# Altium schematic sheet Connector.SchDoc
size A2; SheetNumber: 2; SheetTotal: 6
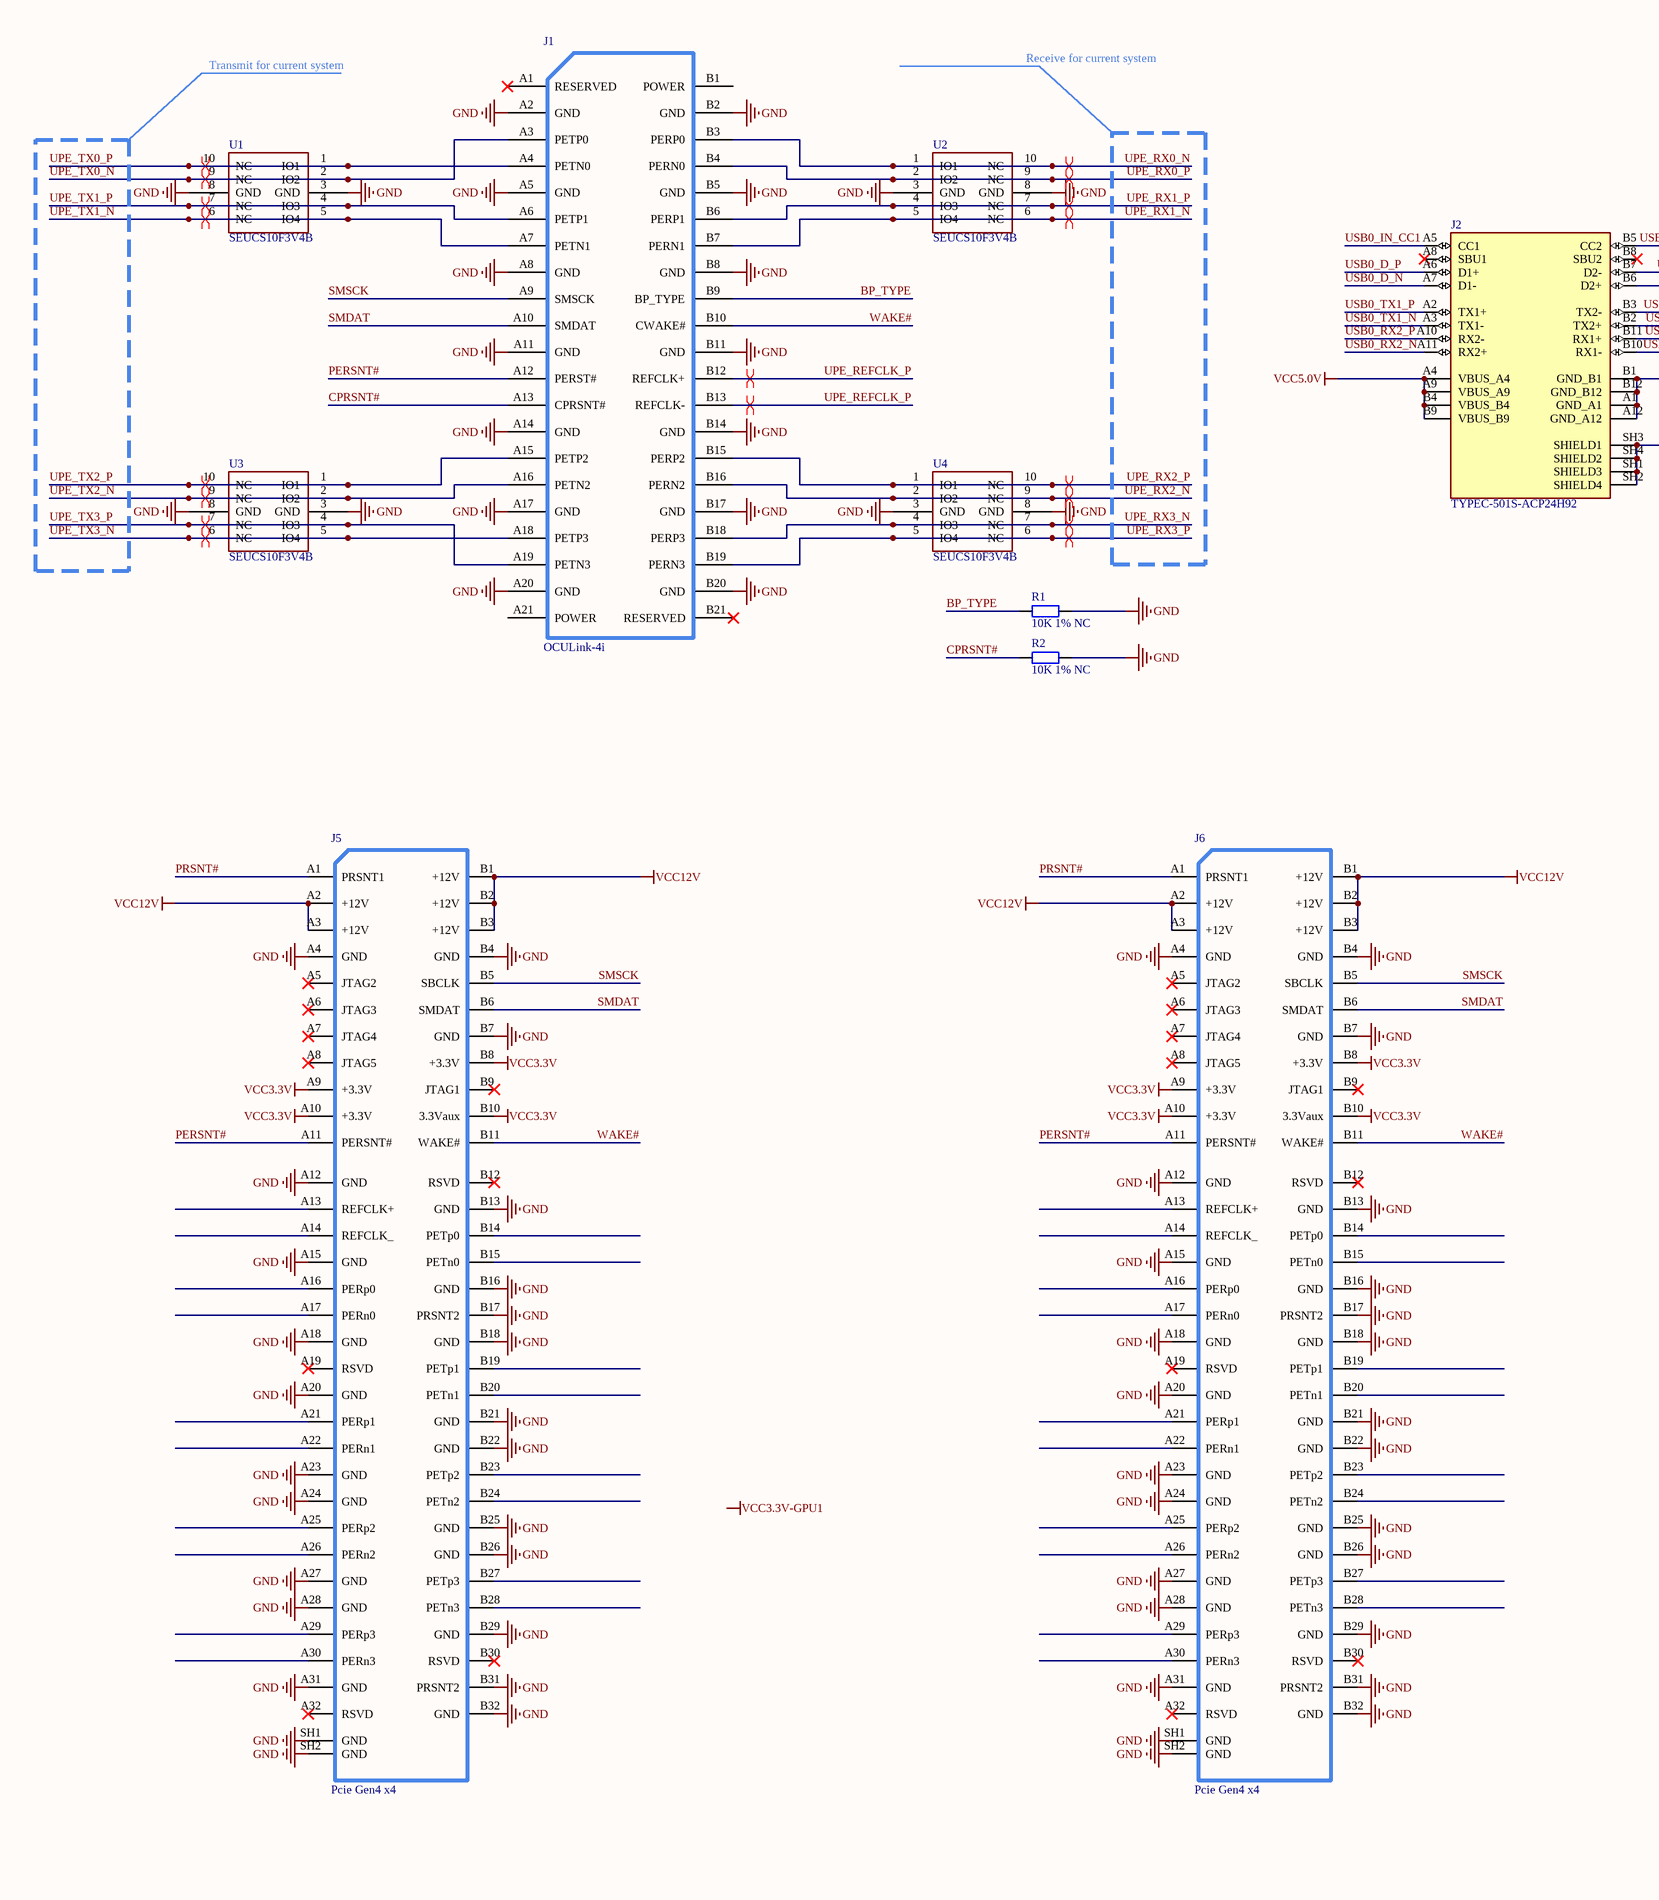
[diagram p0: Connector.SchDoc, left]
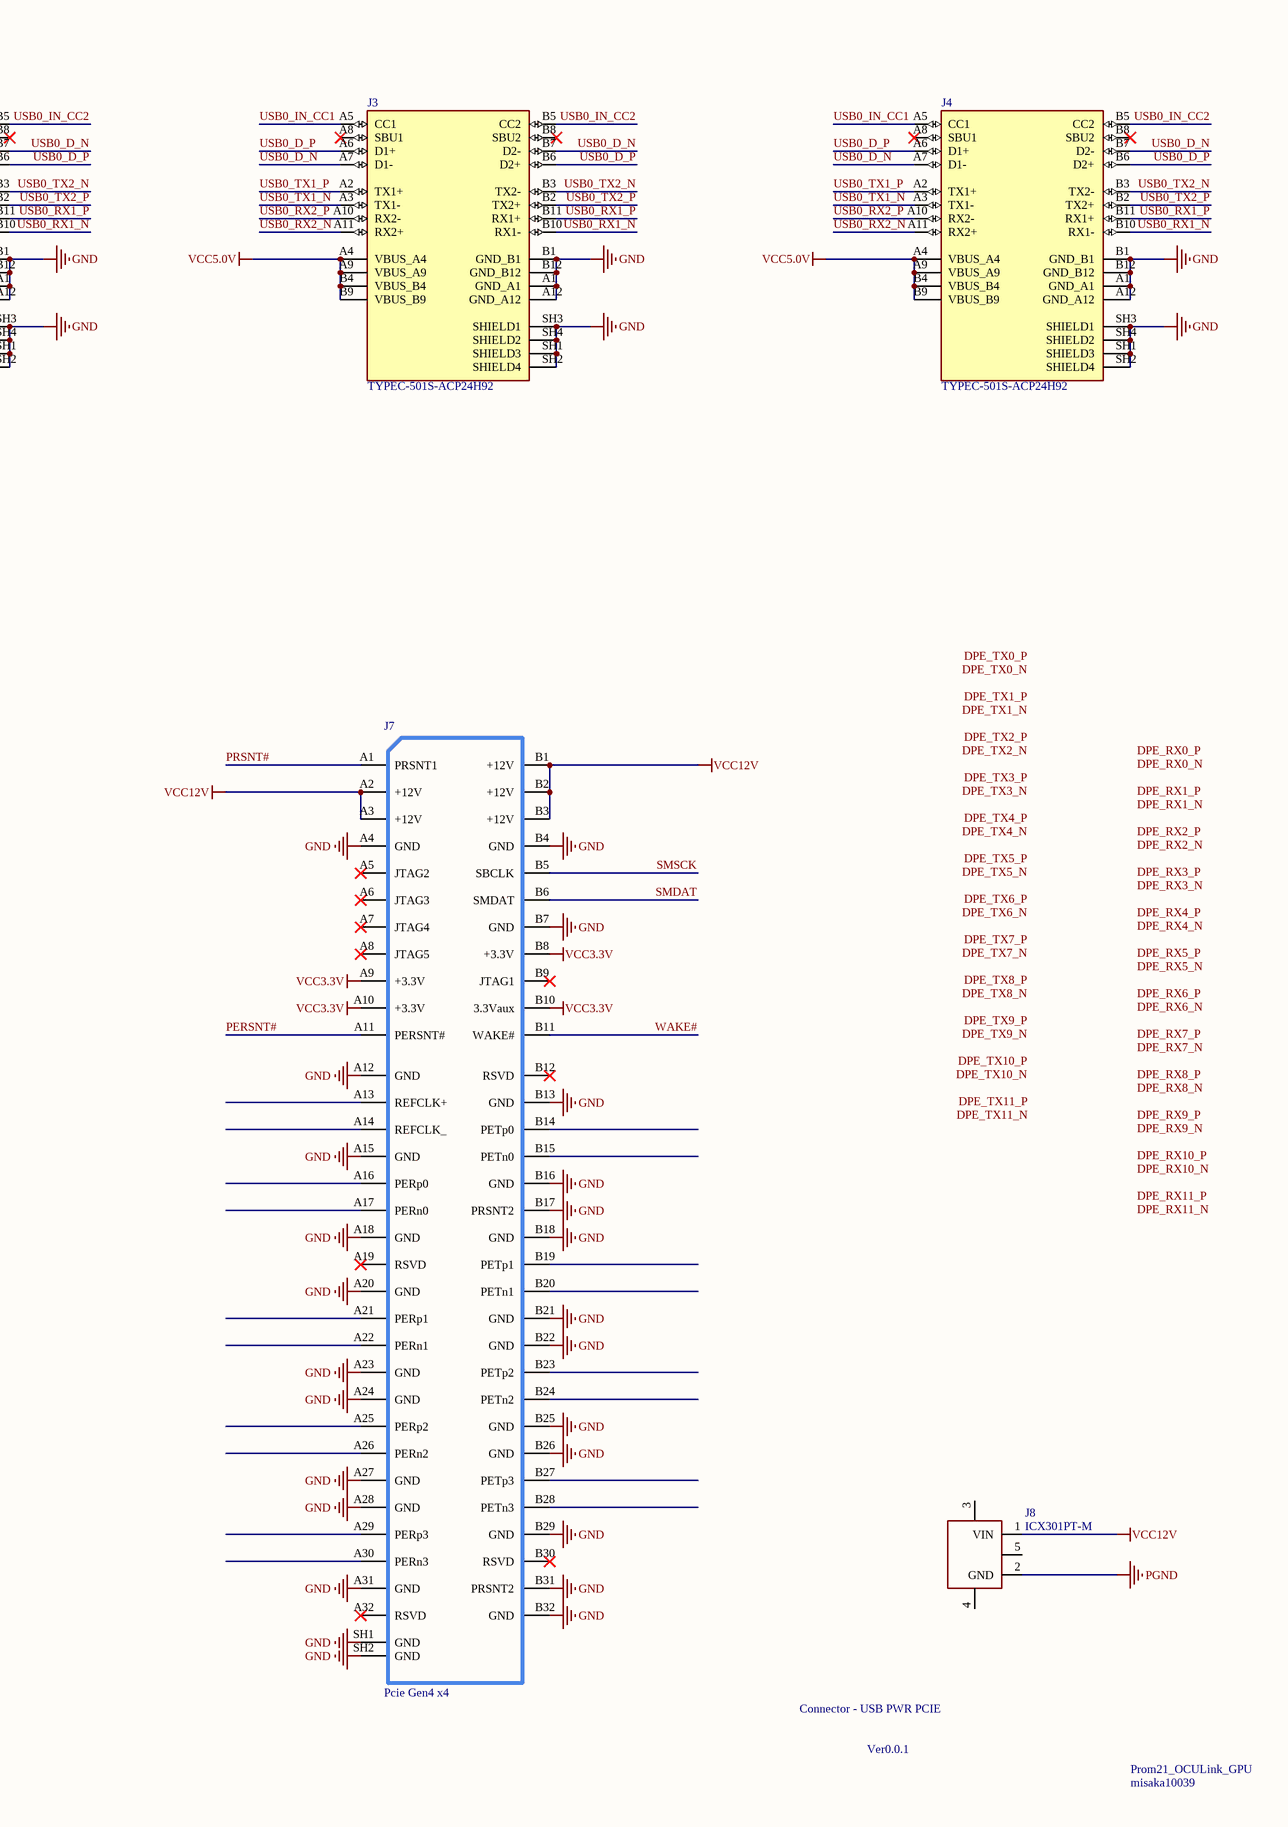
[diagram p1: Connector.SchDoc, right]

## Parts
J1  OCULink-4i  [SFF8611_卧式]
J2  TYPEC-501S-ACP24H92  [USB-C 24P Molex]
J3  TYPEC-501S-ACP24H92  [USB-C 24P Molex]
J4  TYPEC-501S-ACP24H92  [USB-C 24P Molex]
J5  Pcie Gen4 x4  [PCIe Gen4 X4 贴片]
J6  Pcie Gen4 x4  [PCIe Gen4 X4 贴片]
J7  Pcie Gen4 x4  [PCIe Gen4 X4 贴片]
J8  ICX301PT-M  [CONN-SMD_ICX301PT-M]
R1  10K 1% NC  [R0402_L]
R2  10K 1% NC  [R0402_L]
U1  SEUCS10F3V4B  [DIO_TPD4E02B04DQAR]
U2  SEUCS10F3V4B  [DIO_TPD4E02B04DQAR]
U3  SEUCS10F3V4B  [DIO_TPD4E02B04DQAR]
U4  SEUCS10F3V4B  [DIO_TPD4E02B04DQAR]

## Nets
GND: J1.A2(GND) J1.A5(GND) J1.A8(GND) J1.A11(GND) J1.A14(GND) J1.A17(GND) J1.A20(GND) J1.B2(GND) J1.B5(GND) J1.B8(GND) J1.B11(GND) J1.B14(GND) J1.B17(GND) J1.B20(GND) J2.A1(GND_A1) J2.A12(GND_A12) J2.B1(GND_B1) J2.B12(GND_B12) J2.SH1(SHIELD3) J2.SH2(SHIELD4) J2.SH3(SHIELD1) J2.SH4(SHIELD2) J3.A1(GND_A1) J3.A12(GND_A12) J3.B1(GND_B1) J3.B12(GND_B12) J3.SH1(SHIELD3) J3.SH2(SHIELD4) J3.SH3(SHIELD1) J3.SH4(SHIELD2) J4.A1(GND_A1) J4.A12(GND_A12) J4.B1(GND_B1) J4.B12(GND_B12) J4.SH1(SHIELD3) J4.SH2(SHIELD4) J4.SH3(SHIELD1) J4.SH4(SHIELD2) J5.A4(GND) J5.A12(GND) J5.A15(GND) J5.A18(GND) J5.A20(GND) J5.A23(GND) J5.A24(GND) J5.A27(GND) J5.A28(GND) J5.A31(GND) J5.B4(GND) J5.B7(GND) J5.B13(GND) J5.B16(GND) J5.B17(PRSNT2) J5.B18(GND) J5.B21(GND) J5.B22(GND) J5.B25(GND) J5.B26(GND) J5.B29(GND) J5.B31(PRSNT2) J5.B32(GND) J5.SH1(GND) J5.SH2(GND) J6.A4(GND) J6.A12(GND) J6.A15(GND) J6.A18(GND) J6.A20(GND) J6.A23(GND) J6.A24(GND) J6.A27(GND) J6.A28(GND) J6.A31(GND) J6.B4(GND) J6.B7(GND) J6.B13(GND) J6.B16(GND) J6.B17(PRSNT2) J6.B18(GND) J6.B21(GND) J6.B22(GND) J6.B25(GND) J6.B26(GND) J6.B29(GND) J6.B31(PRSNT2) J6.B32(GND) J6.SH1(GND) J6.SH2(GND) J7.A4(GND) J7.A12(GND) J7.A15(GND) J7.A18(GND) J7.A20(GND) J7.A23(GND) J7.A24(GND) J7.A27(GND) J7.A28(GND) J7.A31(GND) J7.B4(GND) J7.B7(GND) J7.B13(GND) J7.B16(GND) J7.B17(PRSNT2) J7.B18(GND) J7.B21(GND) J7.B22(GND) J7.B25(GND) J7.B26(GND) J7.B29(GND) J7.B31(PRSNT2) J7.B32(GND) J7.SH1(GND) J7.SH2(GND) R1.1 R2.1 U1.3(GND) U1.8(GND) U2.3(GND) U2.8(GND) U3.3(GND) U3.8(GND) U4.3(GND) U4.8(GND)
PGND: J8.2(GND)
VCC3.3V: J5.A9(+3.3V) J5.A10(+3.3V) J5.B8(+3.3V) J5.B10(3.3Vaux) J6.A9(+3.3V) J6.A10(+3.3V) J6.B8(+3.3V) J6.B10(3.3Vaux) J7.A9(+3.3V) J7.A10(+3.3V) J7.B8(+3.3V) J7.B10(3.3Vaux)
VCC5.0V: J2.A4(VBUS_A4) J2.A9(VBUS_A9) J2.B4(VBUS_B4) J2.B9(VBUS_B9) J3.A4(VBUS_A4) J3.A9(VBUS_A9) J3.B4(VBUS_B4) J3.B9(VBUS_B9) J4.A4(VBUS_A4) J4.A9(VBUS_A9) J4.B4(VBUS_B4) J4.B9(VBUS_B9)
VCC12V: J5.A2(+12V) J5.A3(+12V) J5.B1(+12V) J5.B2(+12V) J5.B3(+12V) J6.A2(+12V) J6.A3(+12V) J6.B1(+12V) J6.B2(+12V) J6.B3(+12V) J7.A2(+12V) J7.A3(+12V) J7.B1(+12V) J7.B2(+12V) J7.B3(+12V) J8.1(VIN)
BP_TYPE: J1.B9(BP_TYPE) R1.2
CPRSNT#: J1.A13(CPRSNT#) R2.2
PERSNT#: J1.A12(PERST#) J5.A11(PERSNT#) J6.A11(PERSNT#) J7.A11(PERSNT#)
PRSNT#: J5.A1(PRSNT1) J6.A1(PRSNT1) J7.A1(PRSNT1)
SMDAT: J1.A10(SMDAT) J5.B6(SMDAT) J6.B6(SMDAT) J7.B6(SMDAT)
SMSCK: J1.A9(SMSCK) J5.B5(SBCLK) J6.B5(SBCLK) J7.B5(SBCLK)
UPE_REFCLK_P: J1.B12(REFCLK+) J1.B13(REFCLK-)
UPE_RX0_N: J1.B3(PERP0) U2.1(IO1) U2.10(NC)
UPE_RX0_P: J1.B4(PERN0) U2.2(IO2) U2.9(NC)
UPE_RX1_N: J1.B7(PERN1) U2.5(IO4) U2.6(NC)
UPE_RX1_P: J1.B6(PERP1) U2.4(IO3) U2.7(NC)
UPE_RX2_N: J1.B16(PERN2) U4.2(IO2) U4.9(NC)
UPE_RX2_P: J1.B15(PERP2) U4.1(IO1) U4.10(NC)
UPE_RX3_N: J1.B18(PERP3) U4.4(IO3) U4.7(NC)
UPE_RX3_P: J1.B19(PERN3) U4.5(IO4) U4.6(NC)
UPE_TX0_N: J1.A3(PETP0) U1.2(IO2) U1.9(NC)
UPE_TX0_P: J1.A4(PETN0) U1.1(IO1) U1.10(NC)
UPE_TX1_N: J1.A7(PETN1) U1.5(IO4) U1.6(NC)
UPE_TX1_P: J1.A6(PETP1) U1.4(IO3) U1.7(NC)
UPE_TX2_N: J1.A16(PETN2) U3.2(IO2) U3.9(NC)
UPE_TX2_P: J1.A15(PETP2) U3.1(IO1) U3.10(NC)
UPE_TX3_N: J1.A18(PETP3) U3.5(IO4) U3.6(NC)
UPE_TX3_P: J1.A19(PETN3) U3.4(IO3) U3.7(NC)
USB0_D_N: J2.A7(D1-) J2.B7(D2-) J3.A7(D1-) J3.B7(D2-) J4.A7(D1-) J4.B7(D2-)
USB0_D_P: J2.A6(D1+) J2.B6(D2+) J3.A6(D1+) J3.B6(D2+) J4.A6(D1+) J4.B6(D2+)
USB0_IN_CC1: J2.A5(CC1) J3.A5(CC1) J4.A5(CC1)
USB0_IN_CC2: J2.B5(CC2) J3.B5(CC2) J4.B5(CC2)
USB0_RX1_N: J2.B10(RX1-) J3.B10(RX1-) J4.B10(RX1-)
USB0_RX1_P: J2.B11(RX1+) J3.B11(RX1+) J4.B11(RX1+)
USB0_RX2_N: J2.A11(RX2+) J3.A11(RX2+) J4.A11(RX2+)
USB0_RX2_P: J2.A10(RX2-) J3.A10(RX2-) J4.A10(RX2-)
USB0_TX1_N: J2.A3(TX1-) J3.A3(TX1-) J4.A3(TX1-)
USB0_TX1_P: J2.A2(TX1+) J3.A2(TX1+) J4.A2(TX1+)
USB0_TX2_N: J2.B3(TX2-) J3.B3(TX2-) J4.B3(TX2-)
USB0_TX2_P: J2.B2(TX2+) J3.B2(TX2+) J4.B2(TX2+)
WAKE#: J1.B10(CWAKE#) J5.B11(WAKE#) J6.B11(WAKE#) J7.B11(WAKE#)

Not connected (* = marked no-connect by the designer): J1 A1(RESERVED)* A21(POWER) B1(POWER) B21(RESERVED)*; J2 A8(SBU1)* B8(SBU2)*; J3 A8(SBU1)* B8(SBU2)*; J4 A8(SBU1)* B8(SBU2)*; J5 A5(JTAG2)* A6(JTAG3)* A7(JTAG4)* A8(JTAG5)* A13(REFCLK+) A14(REFCLK_) A16(PERp0) A17(PERn0) A19(RSVD)* A21(PERp1) A22(PERn1) A25(PERp2) A26(PERn2) A29(PERp3) A30(PERn3) A32(RSVD)* B9(JTAG1)* B12(RSVD)* B14(PETp0) B15(PETn0) B19(PETp1) B20(PETn1) B23(PETp2) B24(PETn2) B27(PETp3) B28(PETn3) B30(RSVD)*; J6 A5(JTAG2)* A6(JTAG3)* A7(JTAG4)* A8(JTAG5)* A13(REFCLK+) A14(REFCLK_) A16(PERp0) A17(PERn0) A19(RSVD)* A21(PERp1) A22(PERn1) A25(PERp2) A26(PERn2) A29(PERp3) A30(PERn3) A32(RSVD)* B9(JTAG1)* B12(RSVD)* B14(PETp0) B15(PETn0) B19(PETp1) B20(PETn1) B23(PETp2) B24(PETn2) B27(PETp3) B28(PETn3) B30(RSVD)*; J7 A5(JTAG2)* A6(JTAG3)* A7(JTAG4)* A8(JTAG5)* A13(REFCLK+) A14(REFCLK_) A16(PERp0) A17(PERn0) A19(RSVD)* A21(PERp1) A22(PERn1) A25(PERp2) A26(PERn2) A29(PERp3) A30(PERn3) A32(RSVD)* B9(JTAG1)* B12(RSVD)* B14(PETp0) B15(PETn0) B19(PETp1) B20(PETn1) B23(PETp2) B24(PETn2) B27(PETp3) B28(PETn3) B30(RSVD)*; J8 3 4 5

## Layout directives
differential pair: UPE_REFCLK_P, UPE_RX0_N, UPE_RX0_P, UPE_RX1_N, UPE_RX1_P, UPE_RX2_N, UPE_RX2_P, UPE_RX3_N, UPE_RX3_P, UPE_TX0_N, UPE_TX0_P, UPE_TX1_N, UPE_TX1_P, UPE_TX2_N, UPE_TX2_P, UPE_TX3_N, UPE_TX3_P

## Notes on the sheet
- Transmit for current system
- Receive for current system
- Connector - USB PWR PCIE
- Ver0.0.1
- misaka10039
- Prom21_OCULink_GPU
- Labels drawn without touching a wire or pin: DPE_RX0_N, DPE_RX0_P, DPE_RX1_N, DPE_RX1_P, DPE_RX2_N, DPE_RX2_P, DPE_RX3_N, DPE_RX3_P, DPE_RX4_N, DPE_RX4_P, DPE_RX5_N, DPE_RX5_P, DPE_RX6_N, DPE_RX6_P, DPE_RX7_N, DPE_RX7_P, DPE_RX8_N, DPE_RX8_P, DPE_RX9_N, DPE_RX9_P, DPE_RX10_N, DPE_RX10_P, DPE_RX11_N, DPE_RX11_P, DPE_TX0_N, DPE_TX0_P, DPE_TX1_N, DPE_TX1_P, DPE_TX2_N, DPE_TX2_P, DPE_TX3_N, DPE_TX3_P, DPE_TX4_N, DPE_TX4_P, DPE_TX5_N, DPE_TX5_P, DPE_TX6_N, DPE_TX6_P, DPE_TX7_N, DPE_TX7_P, DPE_TX8_N, DPE_TX8_P, DPE_TX9_N, DPE_TX9_P, DPE_TX10_N, DPE_TX10_P, DPE_TX11_N, DPE_TX11_P, VCC3.3V-GPU1

## Library data of the parts
J2-J4 = Typec 24p: USB-C (USB TYPE-C) USB 3.2 Gen 2 (USB 3.1 Gen 2, Superspeed + (USB 3.1)) Receptacle Connector 24 Position Surface Mount, Right Angle; Through Hole; MF: Molex; MP: 1054500101; SnapEDA_Link: https://www.snapeda.com/parts/1054500101/Molex/view-part/?ref=snap; Package: None; Value: *; Check_prices: https://www.snapeda.com/parts/1054500101/Molex/view-part/?ref=eda
R1 R2 = R: 贴片电阻; 版权归属: 源创客; BOM名称: 贴片电阻; 学习资源: www.ooocke.com
U1-U4 = TPD4E02B04: ESD